# Altium schematic sheet tsac-distribution.SchDoc: tsac-distribution
size A4; Date: 05.10.2017; CheckedBy: UNCHECKED; Author: Leon Loeser; Organization: Baltic Racing; Address1: Zur Schwedenschanze 15; Address2: Haus 18; Address3: 18435 Stralsund; Revision: xx.xx; SheetNumber: 1; SheetTotal: 9; Rules: TODO; ProjectName: Projekt
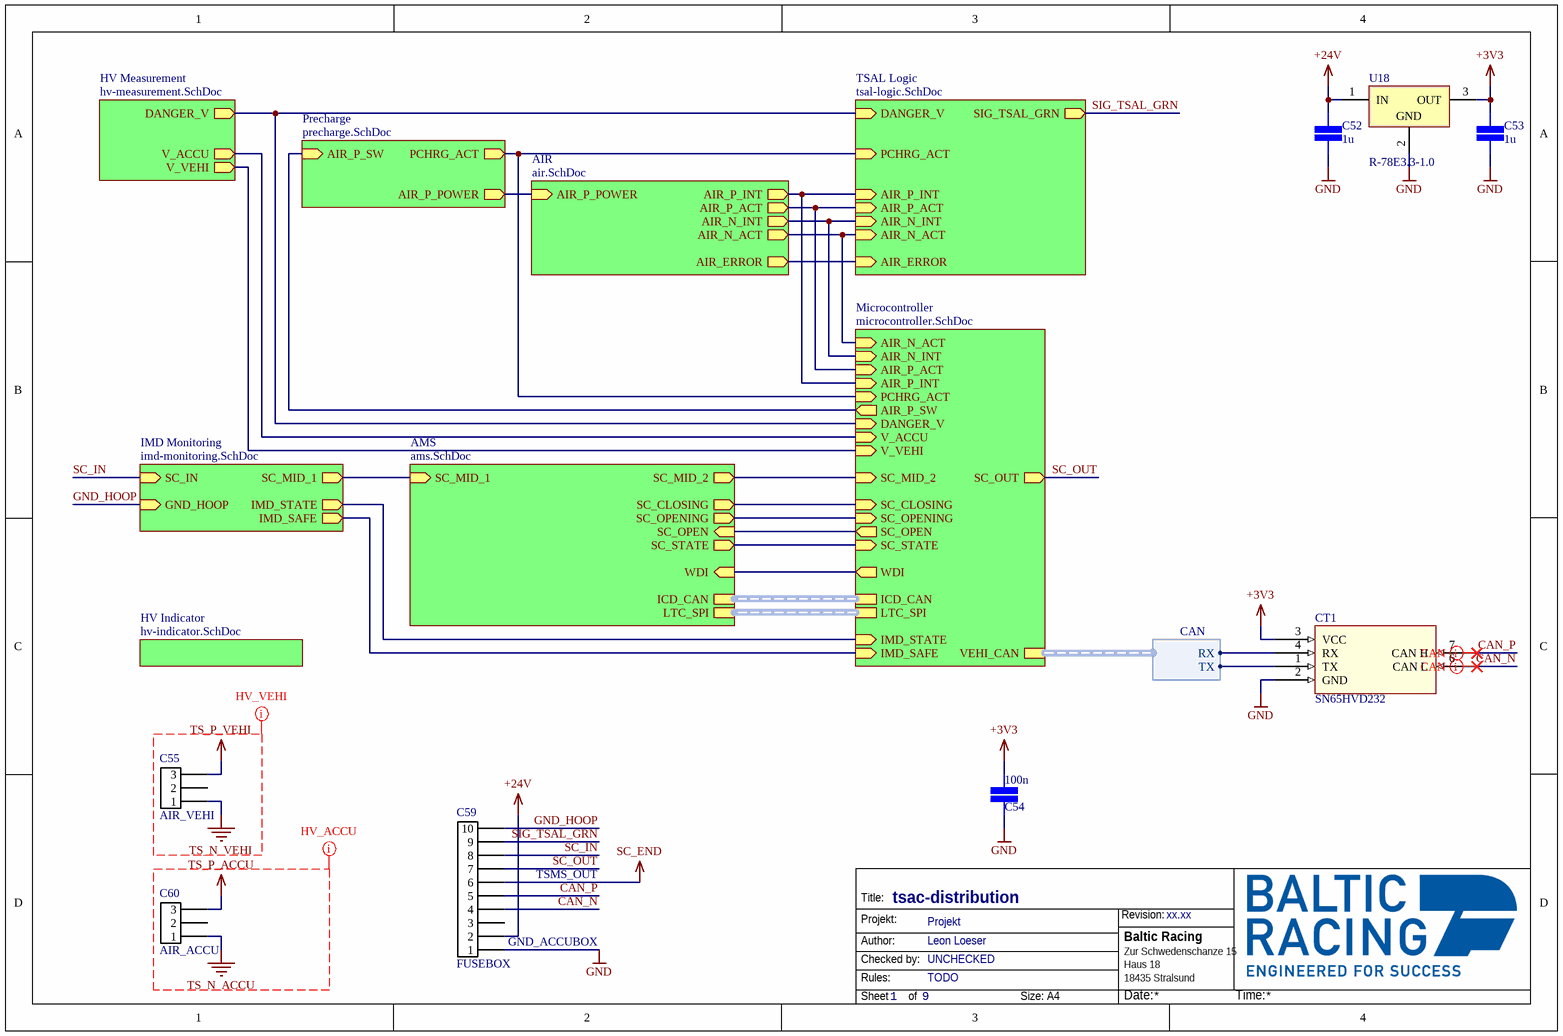
[diagram p0: tsac-distribution.SchDoc]

## Parts
C52  value 1u  [CAP 0805/2012]  (hidden comment: SMD Capacitor)
C53  value 1u  [CAP 0805/2012]  (hidden comment: SMD Capacitor)
C54  value 100n  [CAP 0603/1608]  (hidden comment: SMD Capacitor)
C55  AIR_VEHI  [43650-0315]
C59  FUSEBOX  [43045-1012]
C60  AIR_ACCU  [43650-0315]
CT1  SN65HVD232  [SOIC8 CAN-Transceiver]
U18  R-78E3.3-1.0  [SIP3_RECOM]

## Sub-sheets
AIR = air.SchDoc: AIR_P_INT (out), AIR_N_INT (out), AIR_P_POWER (in), AIR_P_ACT (out), AIR_N_ACT (out), AIR_ERROR (out)
AMS = ams.SchDoc: SC_CLOSING (out), SC_OPEN (in), WDI (in), SC_OPENING (out), SC_STATE (out), SC_MID_1 (in), SC_MID_2 (out), ICD_CAN (harness CAN), LTC_SPI (harness SPI)
HV Indicator = hv-indicator.SchDoc: no entries
HV Measurement = hv-measurement.SchDoc: DANGER_V (out), V_ACCU (out), V_VEHI (out)
IMD Monitoring = imd-monitoring.SchDoc: SC_IN (in), IMD_STATE (out), GND_HOOP (in), SC_MID_1 (out), IMD_SAFE (out)
Microcontroller = microcontroller.SchDoc: SC_OPEN (out), SC_CLOSING (in), SC_OPENING (in), ICD_CAN (harness CAN), LTC_SPI (harness SPI), VEHI_CAN (harness CAN), SC_STATE (in), WDI (out), IMD_SAFE (in), IMD_STATE (in), PCHRG_ACT (in), DANGER_V (in), AIR_P_INT (in), AIR_P_ACT (in), AIR_N_INT (in), AIR_N_ACT (in), V_ACCU (in), V_VEHI (in), AIR_P_SW (out), SC_MID_2 (in), SC_OUT (out)
Precharge = precharge.SchDoc: PCHRG_ACT (out), AIR_P_POWER (out), AIR_P_SW (in)
TSAL Logic = tsal-logic.SchDoc: SIG_TSAL_GRN (out), PCHRG_ACT (in), DANGER_V (in), AIR_P_INT (in), AIR_P_ACT (in), AIR_N_INT (in), AIR_N_ACT (in), AIR_ERROR (in)

## Harnesses
CAN: TX, RX

## Nets
+3V3: C53.1 C54.1 CT1.3(VCC) U18.3(OUT)
+24V: C52.1 C59.2 U18.1(IN)
GND: C52.2 C53.2 C54.2 C59.1 CT1.2(GND) U18.2(GND)
SC_END: C59.6
TS_N_ACCU: C60.1
TS_N_VEHI: C55.1
TS_P_ACCU: C60.3
TS_P_VEHI: C55.3
CAN_N: C59.4 CT1.6(CAN_L)
CAN_P: C59.5 CT1.7(CAN_H)
GND_HOOP: C59.10 ; sheet IMD Monitoring/GND_HOOP
SC_IN: C59.8 ; sheet IMD Monitoring/SC_IN
SC_OUT: C59.7 ; sheet Microcontroller/SC_OUT
SIG_TSAL_GRN: C59.9 ; sheet TSAL Logic/SIG_TSAL_GRN
NetCT1_1: CT1.1(TX) ; sheet Microcontroller/VEHI_CAN.TX
NetCT1_4: CT1.4(RX) ; sheet Microcontroller/VEHI_CAN.RX
(unnamed): sheet AIR/AIR_P_INT, sheet Microcontroller/AIR_P_INT, sheet TSAL Logic/AIR_P_INT
(unnamed): sheet AIR/AIR_N_INT, sheet Microcontroller/AIR_N_INT, sheet TSAL Logic/AIR_N_INT
(unnamed): sheet AIR/AIR_P_POWER, sheet Precharge/AIR_P_POWER
(unnamed): sheet AIR/AIR_P_ACT, sheet Microcontroller/AIR_P_ACT, sheet TSAL Logic/AIR_P_ACT
(unnamed): sheet AIR/AIR_N_ACT, sheet Microcontroller/AIR_N_ACT, sheet TSAL Logic/AIR_N_ACT
(unnamed): sheet AIR/AIR_ERROR, sheet TSAL Logic/AIR_ERROR
(unnamed): sheet AMS/SC_CLOSING, sheet Microcontroller/SC_CLOSING
(unnamed): sheet AMS/SC_OPEN, sheet Microcontroller/SC_OPEN
(unnamed): sheet AMS/WDI, sheet Microcontroller/WDI
(unnamed): sheet AMS/SC_OPENING, sheet Microcontroller/SC_OPENING
(unnamed): sheet AMS/SC_STATE, sheet Microcontroller/SC_STATE
(unnamed): sheet AMS/SC_MID_1, sheet IMD Monitoring/SC_MID_1
(unnamed): sheet AMS/SC_MID_2, sheet Microcontroller/SC_MID_2
(unnamed): sheet HV Measurement/DANGER_V, sheet Microcontroller/DANGER_V, sheet TSAL Logic/DANGER_V
(unnamed): sheet HV Measurement/V_ACCU, sheet Microcontroller/V_ACCU
(unnamed): sheet HV Measurement/V_VEHI, sheet Microcontroller/V_VEHI
(unnamed): sheet IMD Monitoring/IMD_STATE, sheet Microcontroller/IMD_STATE
(unnamed): sheet IMD Monitoring/IMD_SAFE, sheet Microcontroller/IMD_SAFE
(unnamed): sheet Microcontroller/PCHRG_ACT, sheet TSAL Logic/PCHRG_ACT, sheet Precharge/PCHRG_ACT
(unnamed): sheet Microcontroller/AIR_P_SW, sheet Precharge/AIR_P_SW

Not connected (* = marked no-connect by the designer): C55 2; C59 3; C60 2; CT1 5(NC) 8(NC)

## Buses and harness runs
harness sheet AMS/ICD_CAN = sheet Microcontroller/ICD_CAN
harness sheet AMS/LTC_SPI = sheet Microcontroller/LTC_SPI

## Layout directives
differential pair: CAN_N, CAN_P
net class HV_VEHI: TS_N_VEHI, TS_P_VEHI
net class HV_ACCU: TS_N_ACCU, TS_P_ACCU

## Notes on the sheet
- TSMS_OUT
- GND_ACCUBOX
- Title:
- Projekt:
- Revision:
- Author:
- Rules:
- Checked by:
- Sheet
- of
- Size:
- A4
- Date:
- Time:

## Library data of the parts
C52 = SMD Capacitor: Capacitor with multiple Footprints; Voltage: 25V
C53 C54 = SMD Capacitor: Capacitor with multiple Footprints; Voltage: 6.3V
C55 C60 = MicroFit3.0 3-Pin: Molex MicroFit3.0 3-Pin
C59 = MicroFit3.0 10-Pin: Micro-Fit 3.0 10-Pin / 600V / 8.5V
CT1 = SN65HVD232: Standard CAN-Transciever 3.3V
U18 = R-78E3.3-1.0: Nonisolated 3.3V Switchmode converter